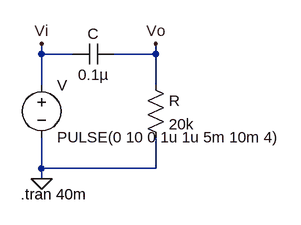
[diagram p0: schematic lab7-2.asc]
lab7-2.asc, the LTspice schematic file:
Version 4
SHEET 1 880 680
WIRE -16 80 -16 64
WIRE 32 80 -16 80
WIRE 160 80 160 64
WIRE 160 80 96 80
WIRE -16 128 -16 80
WIRE 160 128 160 80
WIRE -16 256 -16 208
WIRE 160 256 160 208
WIRE 160 256 -16 256
WIRE -16 272 -16 256
FLAG -16 272 0
FLAG 160 64 Vo
FLAG -16 64 Vi
SYMBOL voltage -16 112 R0
WINDOW 123 0 0 Left 2
WINDOW 39 0 0 Left 2
SYMATTR InstName V
SYMATTR Value PULSE(0 10 0 1u 1u 5m 10m 4)
SYMBOL res 144 112 R0
SYMATTR InstName R
SYMATTR Value 20k
SYMBOL cap 32 96 R270
WINDOW 0 32 32 VTop 2
WINDOW 3 0 32 VBottom 2
SYMATTR InstName C
SYMATTR Value 0.1µ
TEXT -48 296 Left 2 !.tran 40m

The netlist it stands for:
* lab7-2.asc
V Vi 0 PULSE(0 10 0 1u 1u 5m 10m 4)
R Vo 0 20k
C Vi Vo 0.1µ
.tran 40m
.backanno
.end